# Altium schematic sheet SD.SchDoc: RFSOC SAWG
size 420 x 297 mm; Author: G.Kasprowicz; CompanyName: WUT ISE; DrawnBy: G.Kasprowicz; Organization: WUT ISE; Address1: PW ISE; Address2: Nowowiejska 15/19 00-665 Warsaw; Address3: gkasprow@gmail.com; DocumentNumber: 19; Revision: 1; SheetNumber: 19; SheetTotal: 20; ModifiedBy: -; CheckedDate: -; Title2: SD; DivGrp: WUT ISE; Designer: G.Kasprowicz; ModifiedDate: -; ProjectName: Sensor Box
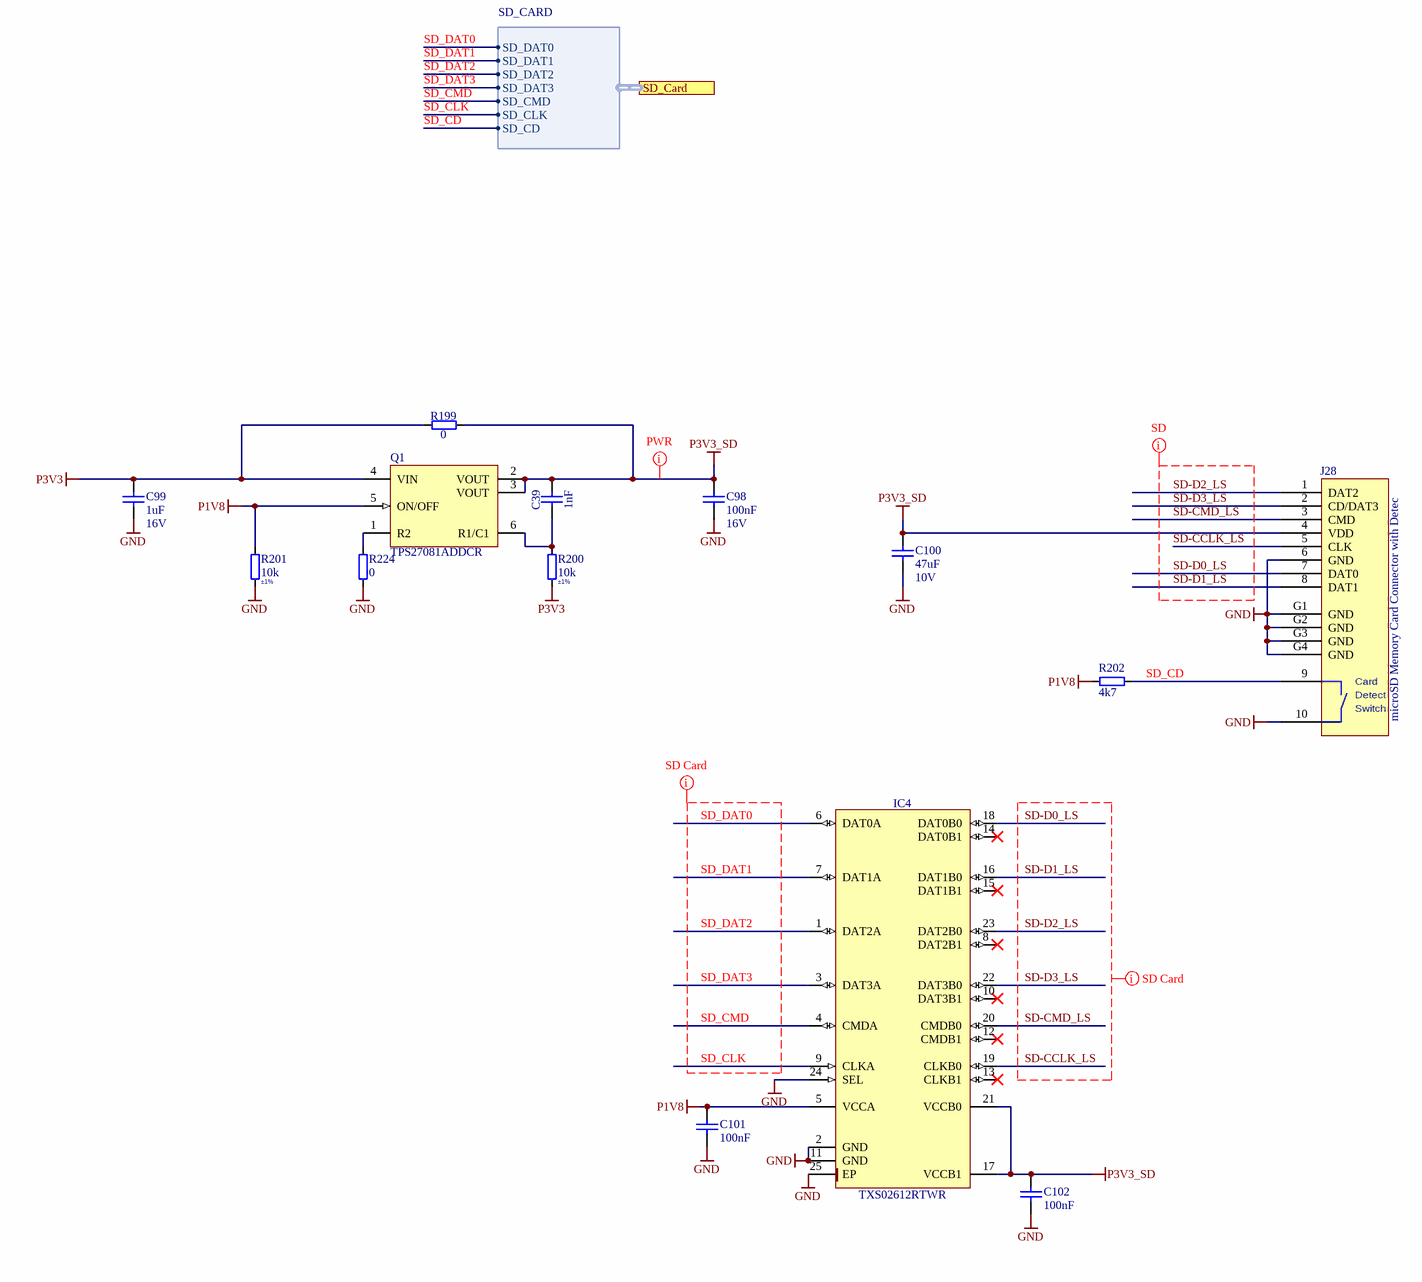
[diagram p0: SD.SchDoc]

## Parts
C39  1nF  [CAPC1005X55N]
C98  100nF  Voltage: 16V  [CAPC1005X55N]
C99  1uF  Voltage: 16V  [CAPC1005X55N]
C100  47uF  Voltage: 10V  [CAPC3216X180N]
C101  100nF  [CAPC1005X55N]
C102  100nF  [CAPC1005X55N]
IC4  TXS02612RTWR  [QFN50P400X400X80-25N-S255]
J28  microSD Memory Card Connector with Detec  [104031-0811]
Q1  TPS27081ADDCR  [SOT95P280X110-6N]
R199  0  [RESC2012X60N]
R200  10k  Tolerance: ±1%  [RESC1005X40N]
R201  10k  Tolerance: ±1%  [RESC1005X40N]
R202  4k7  [RESC1005X40N]
R224  0  [RESC1005X40N]

## Ports
SD_Card (harness SD_CARD)

## Harnesses
SD_CARD: SD_DAT0, SD_DAT1, SD_DAT2, SD_DAT3, SD_CMD, SD_CLK, SD_CD

## Nets
GND: C98.1 C99.2 C100.1 C101.2 C102.2 IC4.2(GND) IC4.11(GND) IC4.24(SEL) IC4.25(EP) J28.6(GND) J28.10(CDSW) J28.G1(GND) J28.G2(GND) J28.G3(GND) J28.G4(GND) R201.2 R224.2
P1V8: C101.1 IC4.5(VCCA) Q1.5(ON/OFF) R201.1 R202.2
P3V3: C99.1 Q1.4(VIN) R199.1 R200.2
P3V3_SD: C39.2 C98.2 C100.2 C102.1 IC4.17(VCCB1) IC4.21(VCCB0) J28.4(VDD) Q1.2(VOUT) Q1.3(VOUT) R199.2
SD-CCLK_LS: IC4.19(CLKB0) J28.5(CLK)
SD-CMD_LS: IC4.20(CMDB0) J28.3(CMD)
SD-D0_LS: IC4.18(DAT0B0) J28.7(DAT0)
SD-D1_LS: IC4.16(DAT1B0) J28.8(DAT1)
SD-D2_LS: IC4.23(DAT2B0) J28.1(DAT2)
SD-D3_LS: IC4.22(DAT3B0) J28.2(CD/DAT3)
SD_CD: J28.9(CDSW) R202.1 ; port SD_Card.SD_CD
SD_CLK: IC4.9(CLKA) ; port SD_Card.SD_CLK
SD_CMD: IC4.4(CMDA) ; port SD_Card.SD_CMD
SD_DAT0: IC4.6(DAT0A) ; port SD_Card.SD_DAT0
SD_DAT1: IC4.7(DAT1A) ; port SD_Card.SD_DAT1
SD_DAT2: IC4.1(DAT2A) ; port SD_Card.SD_DAT2
SD_DAT3: IC4.3(DAT3A) ; port SD_Card.SD_DAT3
NetC39_1: C39.1 Q1.6(R1/C1) R200.1
NetQ1_1: Q1.1(R2) R224.1

Not connected (* = marked no-connect by the designer): IC4 8(DAT2B1)* 10(DAT3B1)* 12(CMDB1)* 13(CLKB1)* 14(DAT0B1)* 15(DAT1B1)*

## Layout directives
net class SD: SD-CCLK_LS, SD-CMD_LS, SD-D0_LS, SD-D1_LS, SD-D2_LS, SD-D3_LS
net class SD Card: SD-CCLK_LS, SD-CMD_LS, SD-D0_LS, SD-D1_LS, SD-D2_LS, SD-D3_LS, SD_CLK, SD_CMD, SD_DAT0, SD_DAT1, SD_DAT2, SD_DAT3
net class PWR: P3V3_SD

## Notes on the sheet
- Project/Equipment
- Document
- Designer
- Drawn by
- Check.by
- Copyright WUT ISE 2020.
  This documentation describes Open Hardware and is licensed under the CERN OHL v.1.2. You may redistribute and modify this documentation under the terms of the CERN OHL v.1.2. (http://ohwr.org/CERNOHL). This documentation is distributed WITHOUT ANY EXPRESS OR IMPLIED WARRANTY, INCLUDING OF MERCHANTABILITY, SATISFACTORY QUALITY AND FITNESS FOR A PARTICULAR PURPOSE. Please see the CERN OHL v.1.2 for applicable conditions.
- Contact
- File
- Last Mod.
- Print Date
- Sheet
- Size
- A3
- of
- Rev
- (in symbol 26322) Card; Detect; Switch

## Library data of the parts
C39 = CC0402_1NF_50V_10%_X7R: Non-polarised capacitor; Part Description: SMD Multilayer Chip Ceramic Capacitor; Manufacturer: GENERIC; Manufacturer1 Part Number: 223858715623; Voltage: 50V; TC: X7R; Tolerance: ±10%; Part Number: CC0402_1NF_50V_10%_X7R; Component Kind: Standard; Component Type: Standard; Pin Count: 2; Value: 1nF; Status: Not Recommended; Manufacturer Part Number: CC0402_1NF_50V_10%_X7R; Case: 0402; Mounted: Yes; Socket: No; SMD: Yes; Sense: No; Manufacturer1 Example: PHYCOMP; Manufacturer1 ComponentHeight: 0.55mm; HelpURL: \\cern.ch\dfs\Applications\Altium\Datasheets\CC0402_X7R_PHYCOMP.pdf; Author: CERN DEM JLC; CreateDate: 03.12.2007; LatestRevisionDate: 03.12.2007
C98 = CC0402_100NF_16V_10%_X7R: Non-polarised capacitor; Part Description: SMD Multilayer Chip Ceramic Capacitor; Manufacturer: GENERIC; Manufacturer1 Part Number: GRM155R71C104KA88D; TC: X7R; Tolerance: ±10%; Case: 0402; Value: 100nF; Part Number: CC0402_100NF_16V_10%_X7R; Component Kind: Standard; Component Type: Standard; Pin Count: 2; Status: Not Recommended; Manufacturer Part Number: CC0402_100NF_16V_10%_X7R; Mounted: Yes; Socket: No; SMD: Yes; Sense: No; Manufacturer1 Example: MURATA; Manufacturer1 ComponentHeight: 0.55mm; HelpURL: \\cern.ch\dfs\Applications\Altium\Datasheets\CC0402_X7R_MURATA_GRM.pdf; Author: CERN DEM JLC; CreateDate: 05.12.2013; LatestRevisionDate: 03.12.2007
C99 = CC0402_1UF_16V_10%_X5R: Non-polarised capacitor; Part Description: SMD Multilayer Chip Ceramic Capacitor; Manufacturer: GENERIC; Manufacturer1 Part Number: C1005X5R1C105KT; Tolerance: ±10%; TC: X5R; Case: 0402; Value: 1uF; Part Number: CC0402_1UF_16V_10%_X5R; Component Kind: Standard; Component Type: Standard; Pin Count: 2; Status: Preferred; Manufacturer Part Number: CC0402_1UF_16V_10%_X5R; Mounted: Yes; Socket: No; SMD: Yes; Sense: No; Manufacturer1 Example: TDK; Manufacturer1 ComponentHeight: 0.55mm; HelpURL: \\cern.ch\dfs\Applications\Altium\Datasheets\CC0402_X5R_TDK_C.pdf; Author: CERN DEM JLC; CreateDate: 25.10.2012; LatestRevisionDate: 25.10.2012
C100 = CC1206_47UF_10V_10%_X5R: Non-polarised capacitor; Part Description: SMD Multilayer Chip Ceramic Capacitor; Manufacturer: GENERIC; Manufacturer1 Part Number: GRM31CR61A476KE15; Tolerance: ±10%; TC: X5R; Case: 1206; Value: 47uF; Part Number: CC1206_47UF_10V_10%_X5R; Component Kind: Standard; Component Type: Standard; Pin Count: 2; Status: None; Manufacturer Part Number: CC1206_47UF_10V_10%_X5R; Mounted: Yes; Socket: No; SMD: Yes; Sense: No; Manufacturer1 Example: MURATA; Manufacturer1 ComponentHeight: 1.8mm; HelpURL: \\cern.ch\dfs\Applications\Altium\Datasheets\CC1206_X5R_MURATA_GRM.pdf; Author: CERN DEM MR; CreateDate: 24.06.2016; LatestRevisionDate: 24.06.2016
C101 C102 = CC0402_100NF_16V_10%_X7R: Non-polarised capacitor; Part Description: SMD Multilayer Chip Ceramic Capacitor; Manufacturer: GENERIC; Manufacturer1 Part Number: GRM155R71C104KA88D; Voltage: 16V; TC: X7R; Tolerance: ±10%; Case: 0402; Value: 100nF; Part Number: CC0402_100NF_16V_10%_X7R; Component Kind: Standard; Component Type: Standard; Pin Count: 2; Status: Not Recommended; Manufacturer Part Number: CC0402_100NF_16V_10%_X7R; Mounted: Yes; Socket: No; SMD: Yes; Sense: No; Manufacturer1 Example: MURATA; Manufacturer1 ComponentHeight: 0.55mm; HelpURL: \\cern.ch\dfs\Applications\Altium\Datasheets\CC0402_X7R_MURATA_GRM.pdf; Author: CERN DEM JLC; CreateDate: 05.12.2013; LatestRevisionDate: 03.12.2007
IC4 = TXS02612RTWR: SDIO Port Expander With Voltage-Level Translation; Manufacturer: TEXAS INSTRUMENTS; PressFit: No; Bonding: No; Part Number: TXS02612RTWR; Component Kind: Standard; Component Type: Standard; Device: TXS02612RTWR; PackageDescription: QFN, 0.50mm Pitch, Square; 24 Pin, 4.00mm L X 4.00mm W X 0.80mm H body (w/Thermal Tab 2.55 X 2.55mm), IPC Medium Density; Part Description: SDIO Port Expander with Voltage-Level Translation; Manufacturer Part Number: TXS02612RTWR; Pin Count: 25; Case: QFN24; Mounted: Yes; Socket: No; SMD: Yes; Sense: No; ComponentHeight: 0.8mm; Author: CERN DEM JLC; HelpURL: \\cern.ch\dfs\Applications\Altium\Datasheets\TXS02612RTWR.pdf; CreateDate: 19.11.2014; LatestRevisionDate: 19.11.2014
J28 = 26322: microSD Memory Card Connector with Detect Switch; Manufacturer Part Number: Molex 104031-0811; AN: 26322; Mixed: SMT; Trenz-Stock: Yes; Temperature-Range: -25/+85; Case: microSD; HelpURL: B:\AD\adlib\datasheet\104031-0811; H-ART: 104031-0811; Storage-Temperature: -10/+60
Q1 = 29262: AN: 29262; Mixed: SMT; Temperature-Range: -40/+85; Extra: 1.2V - 8V, 3A PFET High-Side Load Switch; Case: SOT23-6; HelpURL: b:\AD\adlib\datasheet\TPS27081A\; Manufacturer Part Number: TPS27081ADDCR
R199 = R0805_0R_JUMPER: Resistor; Part Description: 2A (0.05R Max DC Resistance) Zero Ohm Jumper; Manufacturer: GENERIC; Manufacturer1 Part Number: NRC10Z0; PressFit: No; Part Number: R0805_0R_JUMPER; Component Kind: Standard; Component Type: Standard; Pin Count: 2; Value: 0; Status: Preferred; Manufacturer Part Number: R0805_0R_JUMPER; Case: 0805; Mounted: Yes; Sense: No; Socket: No; SMD: Yes; Manufacturer1 Example: NIC COMPONENT; Manufacturer1 ComponentHeight: 0.6mm; HelpURL: \\cern.ch\dfs\Applications\Altium\Datasheets\R0805_NIC_NRC.pdf; Author: CERN DEM JLC; CreateDate: 03.12.2007; LatestRevisionDate: 13.03.2008
R200 R201 = R0402_10K_1%_0.0625W_100PPM: Resistor - 1%; Part Description: General Purpose Thick Film Chip Resistor; Manufacturer: GENERIC; Manufacturer1 Part Number: 232270671003L; TC: ±100ppm/°C; PressFit: No; Case: 0402; Value: 10k; Part Number: R0402_10K_1%_0.0625W_100PPM; Component Kind: Standard; Component Type: Standard; Pin Count: 2; Status: Not Recommended; Power: 0.0625W; Manufacturer Part Number: R0402_10K_1%_0.0625W_100PPM; Mounted: Yes; Sense: No; Socket: No; SMD: Yes; Manufacturer1 Example: YAGEO PHYCOMP; Manufacturer1 ComponentHeight: 0.4mm; HelpURL: \\cern.ch\dfs\Applications\Altium\Datasheets\R0402_Phycomp_RC0402.pdf; Author: CERN DEM JLC; CreateDate: 03.12.2007; LatestRevisionDate: 17.10.2012
R202 = R0402_4K7_1%_0.0625W_100PPM: Resistor - 1%; Part Description: General Purpose Thick Film Chip Resistor; Manufacturer: GENERIC; Manufacturer1 Part Number: 232270674702L; TC: ±100ppm/°C; PressFit: No; Case: 0402; Value: 4k7; Tolerance: ±1%; HelpURL: \\cern.ch\dfs\Applications\Altium\Datasheets\R0402_Phycomp_RC0402.pdf; Part Number: R0402_4K7_1%_0.0625W_100PPM; Component Kind: Standard; Component Type: Standard; Pin Count: 2; Status: Not Recommended; Power: 0.0625W; Manufacturer Part Number: R0402_4K7_1%_0.0625W_100PPM; Mounted: Yes; Sense: No; Socket: No; SMD: Yes; Manufacturer1 Example: YAGEO PHYCOMP; Manufacturer1 ComponentHeight: 0.4mm; Author: CERN DEM JLC; CreateDate: 03.12.2007; LatestRevisionDate: 17.10.2012
R224 = R0402_0R_JUMPER: Resistor; Part Description: 1A (0.05R Max DC Resistance) Zero Ohm Jumper; Manufacturer: GENERIC; Manufacturer1 Part Number: 232270591001L; PressFit: No; Case: 0402; Value: 0; Part Number: R0402_0R_JUMPER; Component Kind: Standard; Component Type: Standard; Pin Count: 2; Status: Not Recommended; Manufacturer Part Number: R0402_0R_JUMPER; Mounted: Yes; Sense: No; Socket: No; SMD: Yes; Manufacturer1 Example: YAGEO PHYCOMP; Manufacturer1 ComponentHeight: 0.4mm; HelpURL: \\cern.ch\dfs\Applications\Altium\Datasheets\R0402_Phycomp_RC0402.pdf; Author: CERN DEM JLC; CreateDate: 03.12.2007; LatestRevisionDate: 17.10.2012